# EAGLE design bsides2020 (EAGLE 9.4.2)
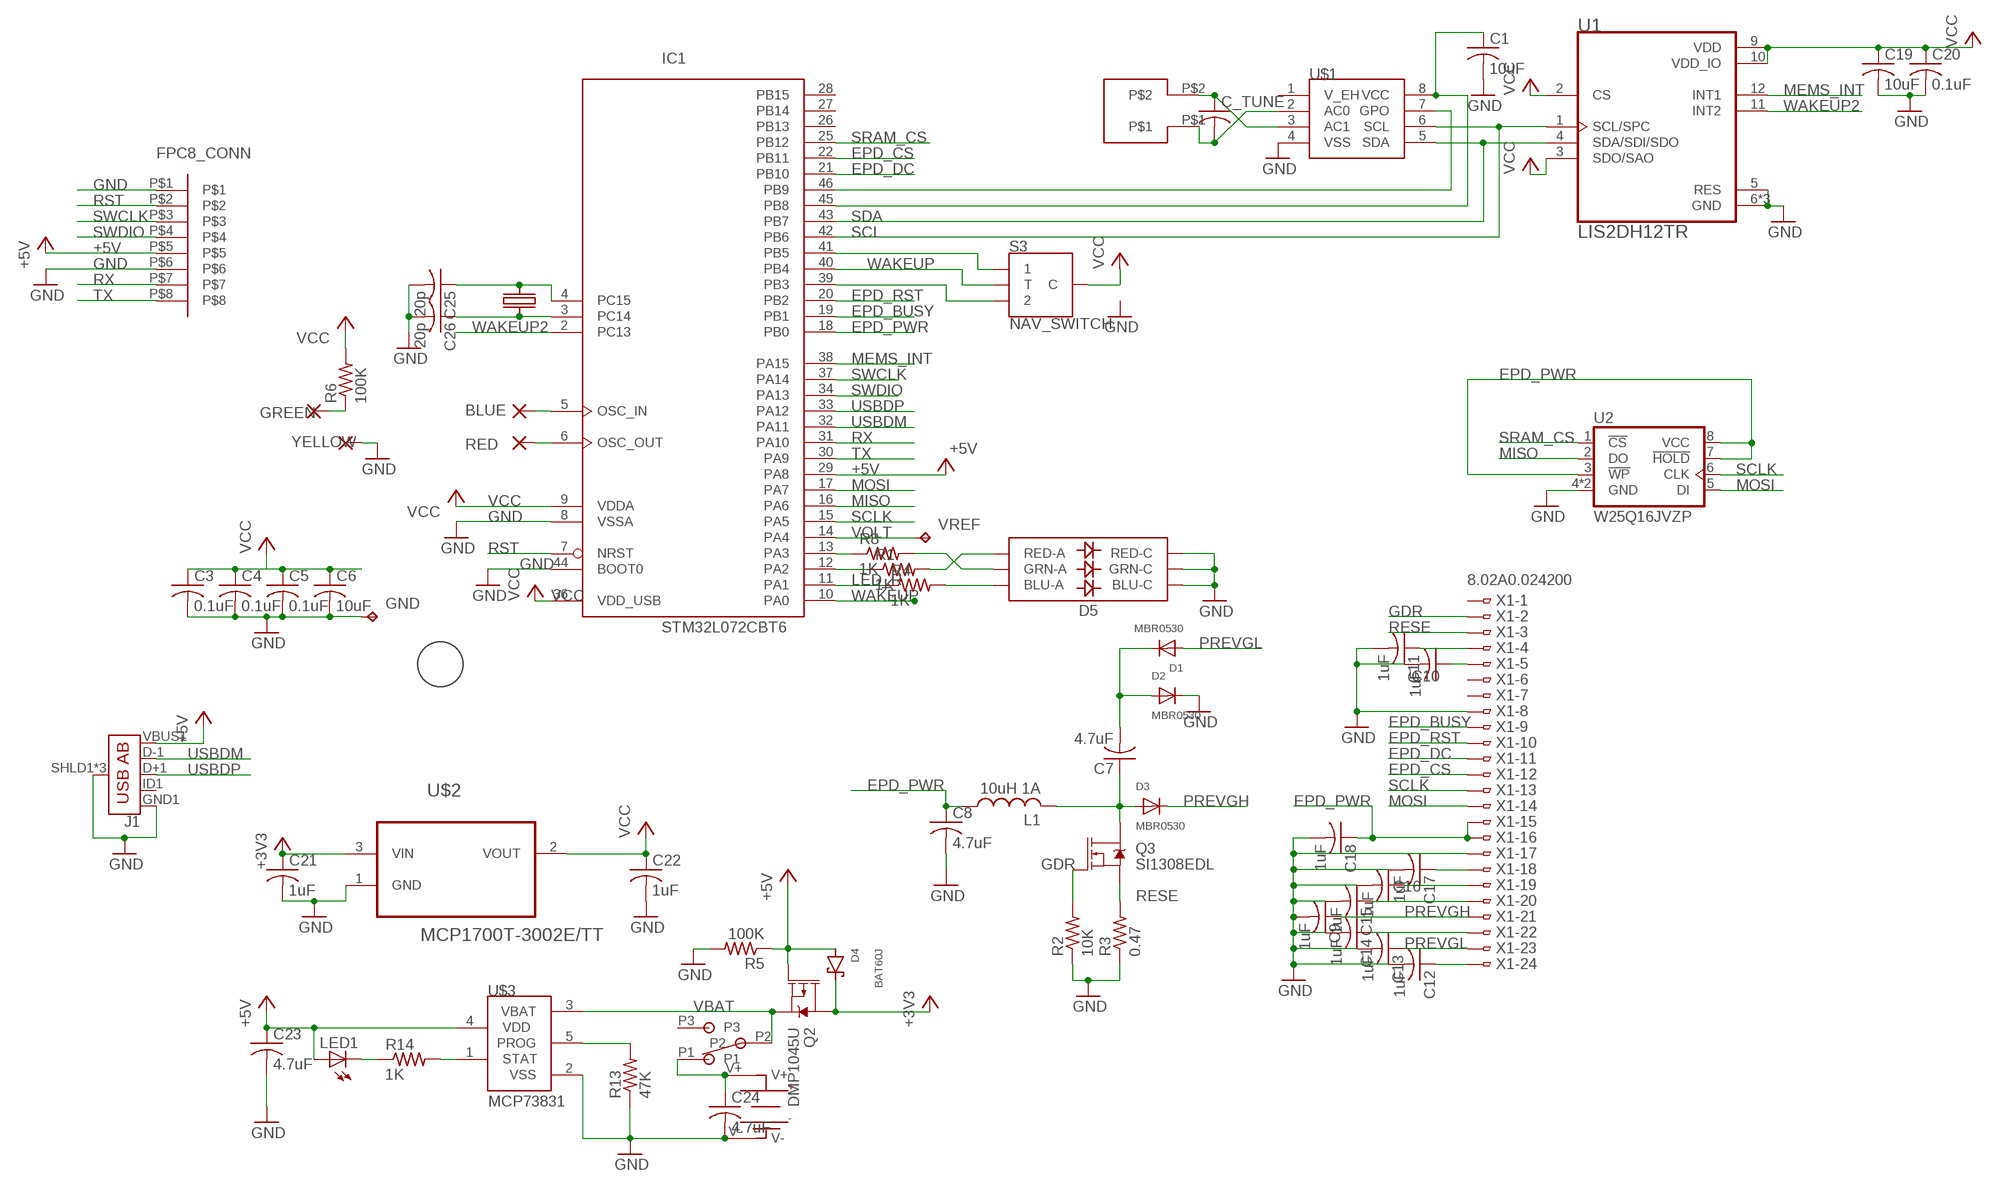
[diagram p0: schematic, sheet 1]

## Parts
BLUE  SMD2  [SMD1,27-2,54]
C1  10uF  C-USC0603  [C0603]
C3  0.1uF  C-USC0603  [C0603]
C4  0.1uF  C-USC0603  [C0603]
C5  0.1uF  C-USC0603  [C0603]
C6  10uF  C-USC0603  [C0603]
C7  4.7uF  C-USC0603  [C0603]
C8  4.7uF  C-USC0603  [C0603]
C9  1uF  C-USC0603  [C0603]
C10  1uF  C-USC0603  [C0603]
C11  1uF  C-USC0603  [C0603]
C12  1uF  C-USC0603  [C0603]
C13  1uF  C-USC0603  [C0603]
C14  1uF  C-USC0603  [C0603]
C15  1uF  C-USC0603  [C0603]
C16  1uF  C-USC0603  [C0603]
C17  1uF  C-USC0603  [C0603]
C18  1uF  C-USC0603  [C0603]
C19  10uF  C-USC0603  [C0603]
C20  0.1uF  C-USC0603  [C0603]
C21  1uF  C-USC0603  [C0603]
C22  1uF  C-USC0603  [C0603]
C23  4.7uF  C-USC0603  [C0603]
C24  4.7uF  C-USC0603  [C0603]
C25  20p  C-USC0603  [C0603]
C26  20p  C-USC0603  [C0603]
C_TUNE  C-USC0603  [C0603]
D1  MBR0530  DIODESOD-123  [SOD-123]
D2  MBR0530  DIODESOD-123  [SOD-123]
D3  MBR0530  DIODESOD-123  [SOD-123]
D4  BAT60J  [SOD323_ST]
D5  RGB  LED-RGBNO_IC  [LED-TRICOLOR-5050]
GND  TPB1,27  [B1,27]
GREEN  SMD2  [SMD1,27-2,54]
IC1  STM32L072CBT6  STM32L052C8T  [LQFP48]
J1  USB_AB_SMT  [USB-AB-MICRO-SMD]
L1  10uH 1A  L-USL2825P  [L2825P]
LED1  LEDCHIPLED_0603  [CHIPLED_0603]
Q2  DMP1045U  MOSFET_PCH-IRLML2244  [SOT23-3]
Q3  SI1308EDL  MOSFET-NCH-AO3404A  [SOT23-3]
R1  1K  R-US_R0603  [R0603]
R2  10K  R-US_R0603  [R0603]
R3  0.47  R-US_R0603  [R0603]
R4  1K  R-US_R0603  [R0603]
R5  100K  R-US_R0603  [R0603]
R6  100K  R-US_R0603  [R0603]
R8  1K  R-US_R0603  [R0603]
R13  47K  R-US_R0603  [R0603]
R14  1K  R-US_R0603  [R0603]
RED  SMD2  [SMD1,27-2,54]
S3  NAV_SWITCH  [NAV_SWITCH]
U1  LIS2DH12TR  LIS2DH12TRLARGE  [LGA-12N]
U2  W25Q16JVZP  W25Q16BVZP  [WSON8]
U$1  ST25DV04K-IER6S3  [SOIC127P600X175-8N]
U$2  MCP1700T-3002E/TT  MCP1700T-3302E/TT  [SOT95P237X112-3N]
U$3  MCP73831  [SOT23-5L]
U$4  ANTANT2  [ANT2]
U$6  20MM_BATTERY180  [20MM_BATTERY_SMD2]
U$7  FPC8_END  [FPC8_END]
U$8  PLUM  [PLUM]
U$9  MSK12C02  [MSK12C02]
U$11  MC-306 32.7680K-A0:ROHS  32KHZCRYSTAL  [32KHZCRYSTAL]
VREF  TPB1,27  [B1,27]
X1  8.02A0.024200  FH12-24S-0.5S  [FPC24]
YELLOW  SMD2  [SMD1,27-2,54]

## Nets
+3V3: C21.1 D4.C Q2.3(D) U$2.3(VIN)
+5V: C23.1 D4.A IC1.29(PA8) J1.VBUS1(VBUS) LED1.A Q2.1(G) R5.1 U$3.4(VDD) U$7.P$5
EPD_BUSY: IC1.19(PB1) X1.P$9
EPD_CS: IC1.22(PB11) X1.P$12
EPD_DC: IC1.21(PB10) X1.P$11
EPD_PWR: C8.1 C18.1 IC1.18(PB0) L1.1 U2.3(!WP!) U2.7(!HOLD!) U2.8(VCC) X1.P$15 X1.P$16
EPD_RST: IC1.20(PB2) X1.P$10
GDR: Q3.1(G) R2.2 X1.P$2
GND: C1.2 C3.2 C4.2 C5.2 C6.2 C8.2 C9.2 C10.2 C11.2 C12.2 C13.2 C14.2 C15.2 C16.2 C17.2 C18.2 C19.2 C20.2 C21.2 C22.2 C23.2 C24.2 C25.2 C26.2 D2.C D5.4(BLU-C) D5.5(RED-C) D5.6(GRN-C) GND.TP IC1.8(VSSA) IC1.44(BOOT0) J1.GND1(GND) J1.SHLD1(SHIELD) J1.SHLD2(SHIELD) J1.SHLD3(SHIELD) R2.1 R3.1 R5.2 R13.1 U1.5(RES) U1.6(GND) U1.7(GND) U1.8(GND) U2.4(GND) U2.9(GND) U$1.4(VSS) U$2.1(GND) U$3.2(VSS) U$6.V- U$7.P$1 U$7.P$6 X1.P$8 X1.P$17 YELLOW.1(P)
LED_R: IC1.11(PA1) R4.1
MEMS_INT: IC1.38(PA15) U1.12(INT1)
MISO: IC1.16(PA6) U2.2(DO)
MOSI: IC1.17(PA7) U2.5(DI) X1.P$14
N$1: R13.2 U$3.5(PROG)
N$2: BLUE.1(P) IC1.5(OSC_IN)
N$3: D5.2(RED-A) R1.2
N$4: D5.1(GRN-A) R8.2
N$5: D5.3(BLU-A) R4.2
N$6: IC1.41(PB5) S3.1
N$7: C24.1 U$6.V+ U$9.P1
N$8: C26.1 IC1.3(PC14) U$11.P$4
N$9: IC1.46(PB9) U$1.7(GPO)
N$10: C_TUNE.2 U$1.2(AC0) U$4.P$1
N$11: C11.1 X1.P$4
N$13: IC1.39(PB3) S3.2
N$14: IC1.12(PA2) R1.1
N$15: IC1.13(PA3) R8.1
N$16: C25.1 IC1.4(PC15) U$11.P$1
N$17: C7.1 D3.A L1.2 Q3.3(D)
N$18: C10.1 X1.P$5
N$19: IC1.6(OSC_OUT) RED.1(P)
N$20: C1.1 IC1.45(PB8) U$1.8(VCC)
N$21: C16.1 X1.P$19
N$22: C15.1 X1.P$20
N$23: C17.1 X1.P$18
N$24: C14.1 X1.P$22
N$25: C12.1 X1.P$24
N$26: GREEN.1(P) R6.1
N$27: C7.2 D1.C D2.A
N$34: C_TUNE.1 U$1.3(AC1) U$4.P$2
N$35: LED1.C R14.1
N$37: R14.2 U$3.1(STAT)
PREVGH: C9.1 D3.C X1.P$21
PREVGL: C13.1 D1.A X1.P$23
RESE: Q3.2(S) R3.2 X1.P$3
RST: IC1.7(NRST) U$7.P$2
RX: IC1.31(PA10) U$7.P$7
SCL: IC1.42(PB6) U1.1(SCL/SPC) U$1.6(SCL)
SCLK: IC1.15(PA5) U2.6(CLK) X1.P$13
SDA: IC1.43(PB7) U1.4(SDA/SDI/SDO) U$1.5(SDA)
SRAM_CS: IC1.25(PB12) U2.1(!CS!)
SWCLK: IC1.37(PA14) U$7.P$3
SWDIO: IC1.34(PA13) U$7.P$4
TX: IC1.30(PA9) U$7.P$8
USBDM: IC1.32(PA11) J1.D-1(D-)
USBDP: IC1.33(PA12) J1.D+1(D+)
VBAT: Q2.2(S) U$3.3(VBAT) U$9.P2
VCC: C3.1 C4.1 C5.1 C6.1 C19.1 C20.1 C22.1 IC1.9(VDDA) IC1.36(VDD_USB) R6.2 S3.C U1.2(CS) U1.3(SDO/SAO) U1.9(VDD) U1.10(VDD_IO) U$2.2(VOUT)
VOLT: IC1.14(PA4) VREF.TP
WAKEUP: IC1.10(PA0) IC1.40(PB4) S3.T
WAKEUP2: IC1.2(PC13) U1.11(INT2)
Unconnected: IC1.26(PB13) IC1.27(PB14) IC1.28(PB15) J1.ID1(USBID) U$1.1(V_EH) U$9.P3 X1.P$1 X1.P$6 X1.P$7

## Power pins joined to a net without a drawn wire
GND: IC1.23(VSS) IC1.35(VSS) IC1.47(VSS)
VCC: IC1.1(VDD) IC1.24(VDD) IC1.48(VDD)

## Library data of the parts
BLUE GREEN RED YELLOW = wirepad:SMD2: SMD PAD
C1 C3-C24 C_TUNE = resistor:C-US: CAPACITOR, American symbol
C25 C26 = adafruit:C-US: CAPACITOR, American symbol; OC_NEWARK: unknown
D1-D3 = adafruit:DIODE: Diode SMADIODE - SMA Surface Mount Package 20V 1A Schottky Diode Digikey: 641-1014-6-ND DO-1N4148 - Through Hole Small Current Diode SOD-123 20V 1 A (.5mV Vf) Schottky Diode - Digikey: MBRX120TPMSCT-ND SOD-323 10V 570mA (.38mV Vf, 3ns) Schottky Diode - Digikey: ZLLS410CT-ND SOD-523 30V 30mA Schottky Diode (RB751S-40TE61) - Digikey: RB751S-40TE61CT-ND SOT23-R/W - SOT23 Package (R = Solder Paste/Reflow Ovens, W = Hand-Soldering) BAT54Film 40V 300mA - Digikey: 497-7162-1-ND
D4 = diode:BAT60J: Schottky barrier diode Source: www.st.com, BAT60J.pdf
D5 = SparkFun-LED:LED-RGB: LED-RGB 6 pin RGB LED (no common connector) Packages: PLCC-6 LED-TRICOLOR-5050 - No built-in IC SparkFun Products: Digital Sandbox <https://www.sparkfun.com/products/12651> LED- SMD RGB <https://www.sparkfun.com/products/10866>; PROD_ID: DIO-10298
GND VREF = testpad:TP: Test pad
IC1 = micro-stm_v2:STM32L052C*T: ARM 32-bit Cortex™-M0+ CPU 32 MHz maximum frequency 32 to 64 Kbytes of Flash memory 2 kbyte of Data EEPROM 8 kbytes of SRAM 37 GPIOs 1.8 to 3.6 V application supply
J1 = SparkFun-Connectors:USB_AB: USB Type AB Micro Connector OTG-compatible. 5 pins, 3 shield pins SparkFun Products: IOIO-OTG <https://www.sparkfun.com/products/13613> SparkFun SAMD21 Mini Breakout <https://www.sparkfun.com/products/13664>; PROD_ID: CONN-11794
L1 = resistor:L-US: INDUCTOR, American symbol
LED1 = led:LED: LED OSRAM: - CHIPLED LG R971, LG N971, LY N971, LG Q971, LY Q971, LO R971, LY R971 LH N974, LH R974 LS Q976, LO Q976, LY Q976 LO Q996 - Hyper CHIPLED LW Q18S LB Q993, LB Q99A, LB R99A - SideLED LS A670, LO A670, LY A670, LG A670, LP A670 LB A673, LV A673, LT A673, LW A673 LH A674 LY A675 LS A676, LA A676, LO A676, LY A676, LW A676 LS A679, LY A679, LG A679 - Hyper Micro SIDELED® LS Y876, LA Y876, LO Y876, LY Y876 LT Y87S - SmartLED LW L88C, LW L88S LB L89C, LB L89S, LG L890 LS L89K, LO L89K, LY L89K LS L896, LA L896, LO L896, LY L896 - TOPLED LS T670, LO T670, LY T670, LG T670, LP T670 LSG T670, LSP T670, LSY T670, LOP T670, LYG T670 LG T671, LOG T671, LSG T671 LB T673, LV T673, LT T673, LW T673 LH T674 LS T676, LA T676, LO T676, LY T676, LB T676, LH T676, LSB T676, LW T676 LB T67C, LV T67C, LT T67C, LS T67K, LO T67K, LY T67K, LW E67C LS E67B, LA E67B, LO E67B, LY E67B, LB E67C, LV E67C, LT E67C LW T67C LS T679, LY T679, LG T679 LS T770, LO T770, LY T770, LG T770, LP T770 LB T773, LV T773, LT T773, LW T773 LH T774 LS E675, LA E675, LY E675, LS T675 LS T776, LA T776, LO T776, LY T776, LB T776 LHGB T686 LT T68C, LB T68C - Hyper Mini TOPLED® LB M676 - Mini TOPLED Santana® LG M470 LS M47K, LO M47K, LY M47K Source: http://www.osram.convergy.de/
Q2 = SparkFun-DiscreteSemi:MOSFET_PCH: P-channel MOSFETs Voltage controlled devices that allow control of high current outputs. SparkFun Products: SparkFun ESP32 Thing <https://www.sparkfun.com/products/13907> SparkFun ESP8266 Thing <https://www.sparkfun.com/products/13231>; PROD_ID: TRANS-11153; VALUE: 4.3A/20V/54mΩ
Q3 = SparkFun-DiscreteSemi:MOSFET-NCH: N-channel MOSFETs Voltage controlled devices that allow control of high current outputs. SparkFun Products: SparkFun OpenScale <https://www.sparkfun.com/products/13261> SparkFun Digital Sandbox <https://www.sparkfun.com/products/12651> SparkFun Monster Moto Shield <https://www.sparkfun.com/products/10182> SparkFun MOSFET Power Controller <https://www.sparkfun.com/products/11214>; PROD_ID: TRANS-12988; VALUE: 5.8A/30V/35mΩ
R1-R6 R8 R13 R14 = resistor:R-US_: RESISTOR, American symbol
S3 = SparkFun-Switches:NAV_SWITCH: Navigation Switch Three way navigation switch. Commonly used as up/down/select on MP3 players. Schematic element and footprint production proven. SparkFun Products Surface Mount Navigation Switch <https://www.sparkfun.com/products/8184> (COM-08184) Used on SparkFun MP3 Trigger <https://www.sparkfun.com/products/13720>; PROD_ID: SWCH-08301; SF_SKU: COM-08184
U1 = grange:LIS2DH12TR: MEMS digital output motion sensor: ultra low-power high performance 3-axes femto accelerometer
U2 = memory-winbond:W25Q16BV: EEPROM 4 Mbit SPI Serial Flash7
U$1 = grange:ST25DV04K-IER6S3
U$2 = Ava:MCP1700T-3302E/TT: Low Quiescent Current LDO; MPN: MCP1700T-3302E/TT; OC_FARNELL: 1296592; OC_NEWARK: 88H9817; PACKAGE: SOT23-3; SUPPLIER: Microchip
U$3 = mcp73831:MCP73831: Miniature Single-Cell, Fully Integrated Li-Ion, Li-Polymer Charge Management Controllers
U$4 = grange:ANT
U$6 = grange:20MM_BATTERY
U$7 = grange:FPC8_END
U$8 = grange:PLUM
U$9 = grange:MSK12C02
U$11 = grange:32KHZCRYSTAL
X1 = grange:FH12-24S-0.5S: 0.5mm Pitch Connectors For FPC/FFC Source: Data sheet <http://www.hirose.co.jp/cataloge_hp/e58605370.pdf>

## Board
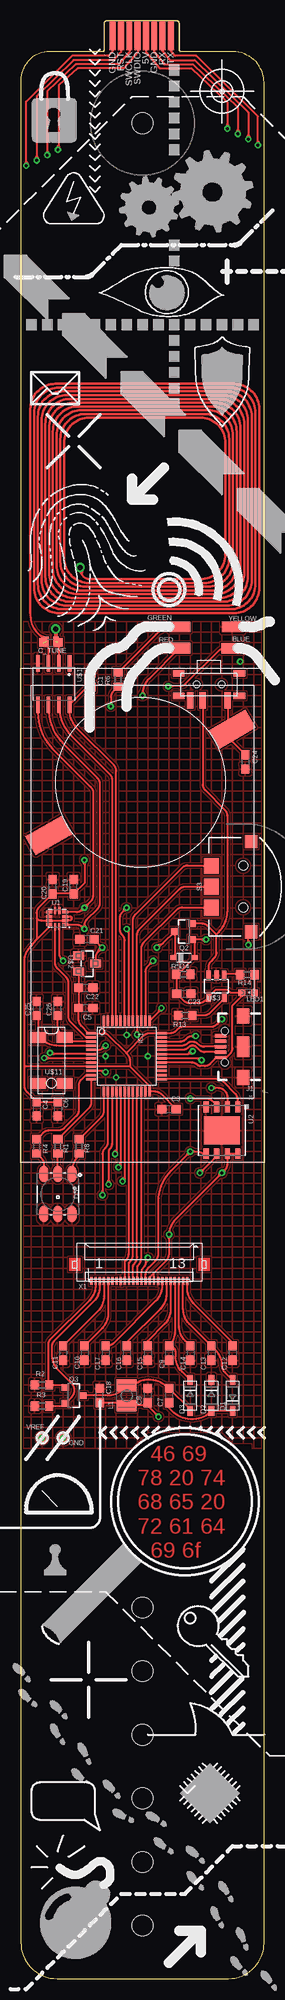
[diagram p1: board, top side]
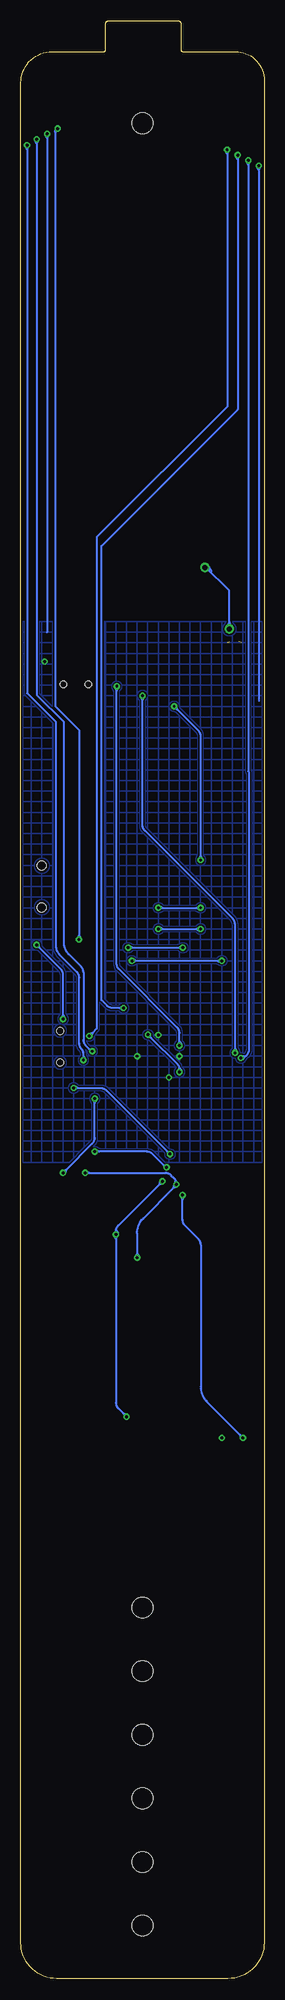
[diagram p2: board, bottom side, seen from below]

Size 29.19 x 234.51 mm. Coordinates in mm from the lower left corner, seen from the top.
Outline: 25.47,230.81 19.3,230.81 arc-90 19,231.11 19,234.21 arc90 18.7,234.51 10.3,234.51 arc90 10,234.21 10,231.11 arc-90 9.7,230.81 3.75,230.81 arc90 0,227.69 0,4.34 arc90 4.34,0 24.89,0 arc90 29.19,4.3 29.19,227.09 arc90 25.47,230.81
Copper layers (1*16): Top 0.035mm / dielectric 1.5mm / Bottom 0.035mm
Design rules "default *": minimum track width 6mil, minimum drill 0.35mm, track to track 6mil, track to pad 6mil, pad to pad 6mil, via to via 6mil, smd to smd 6mil, copper to edge 10mil, drill to drill 6mil, minimum pad ring 10mil, minimum via ring 8mil, stop-mask expansion 4mil, vias tented up to drill 0mil, thermal gap 10mil
Holes 2.5 mm at 14.6,222.25 14.6,6.35 14.6,13.97 14.6,21.59 14.6,29.21 14.6,36.83 14.6,44.45

### Footprints (pad centres in the part's own frame; a part is rotated, then mirrored left to right if it is on the bottom)
SMD1,27-2,54 = smd 1.27 x 2.54: 1 0,0
C0603 = smd 1.1 x 1: 1 -0.85,0; 2 0.85,0
SOD-123 = smd 1.2 x 0.7: A 1.85,0; C -1.85,0
SOD323_ST = smd 0.8 x 0.6: A 1.25,0; C -1.25,0
LED-TRICOLOR-5050 = smd 2 x 1.1: 1 -2.4,1.7; 2 -2.4,0; 3 -2.4,-1.7; 4 2.4,-1.7; 5 2.4,0; 6 2.4,1.7
B1,27 = smd 1.27 x 1.27: TP 0,0
LQFP48 = smd 0.3 x 1.2: 1 -2.75,-4.25; 2 -2.25,-4.25; 3 -1.75,-4.25; 4 -1.25,-4.25; 5 -0.75,-4.25; 6 -0.25,-4.25; 7 0.25,-4.25; 8 0.75,-4.25; 9 1.25,-4.25; 10 1.75,-4.25; 11 2.25,-4.25; 12 2.75,-4.25; 25 2.75,4.25; 26 2.25,4.25; 27 1.75,4.25; 28 1.25,4.25; 29 0.75,4.25; 30 0.25,4.25; 31 -0.25,4.25; 32 -0.75,4.25; 33 -1.25,4.25; 34 -1.75,4.25; 35 -2.25,4.25; 36 -2.75,4.25 | smd 1.2 x 0.3: 13 4.25,-2.75; 14 4.25,-2.25; 15 4.25,-1.75; 16 4.25,-1.25; 17 4.25,-0.75; 18 4.25,-0.25; 19 4.25,0.25; 20 4.25,0.75; 21 4.25,1.25; 22 4.25,1.75; 23 4.25,2.25; 24 4.25,2.75; 37 -4.25,2.75; 38 -4.25,2.25; 39 -4.25,1.75; 40 -4.25,1.25; 41 -4.25,0.75; 42 -4.25,0.25; 43 -4.25,-0.25; 44 -4.25,-0.75; 45 -4.25,-1.25; 46 -4.25,-1.75; 47 -4.25,-2.25; 48 -4.25,-2.75
USB-AB-MICRO-SMD = smd 1.4 x 0.4: D+1 2.7,0; D-1 2.7,0.65; GND1 2.7,-1.3; ID1 2.7,-0.65; VBUS1 2.7,1.3 | smd 1.5 x 1.8: SHLD1 0,-3.68; SHLD2 0,3.68 | smd 1.5 x 2.5: SHLD3 0,0 | hole 0.85: 2.2,1.9; 2.2,-1.9
L2825P = smd 1.4 x 2.4: 1 -1.2,0; 2 1.2,0
CHIPLED_0603 = smd 0.8 x 0.8: A 0,-0.75; C 0,0.75
SOT23-3 = smd 0.8 x 0.9: 1 -0.95,-1; 2 0.95,-1; 3 0,1.1
R0603 = smd 1 x 1.1: 1 -0.85,0; 2 0.85,0
NAV_SWITCH = smd 1.9 x 1.8: 1 -2.5,-3.8; 2 2.5,-3.8; T 0,-3.8 | smd 1.6 x 1.5: C 5.4,0.95; NC -5.4,0.95 | hole 1.1: -2.5,0; 2.5,0
LGA-12N = smd 0.831 x 0.35: 1 -0.956,0.75; 2 -0.956,0.25; 3 -0.956,-0.25; 4 -0.956,-0.75; 7 0.956,-0.75; 8 0.956,-0.25; 9 0.956,0.25; 10 0.956,0.75 | smd 0.35 x 0.831: 5 -0.265,-0.956; 6 0.25,-0.956; 11 0.25,0.956; 12 -0.25,0.956
WSON8 = smd 0.635 x 1.27: 1 -1.905,-2.81; 2 -0.635,-2.81; 3 0.635,-2.81; 4 1.905,-2.81; 5 1.905,2.81; 6 0.635,2.81; 7 -0.635,2.81; 8 -1.905,2.81 | smd 4.3 x 3.4: 9 0,0
SOIC127P600X175-8N = smd 1.97 x 0.57: 1 -2.475,1.905; 2 -2.475,0.635; 3 -2.475,-0.635; 4 -2.475,-1.905; 5 2.475,-1.905; 6 2.475,-0.635; 7 2.475,0.635; 8 2.475,1.905
SOT95P237X112-3N = smd 0.991 x 1.321: 1 -0.94,-1.016; 2 0.94,-1.016; 3 0,1.016
SOT23-5L = smd 0.533 x 1.2: 1 -0.95,-1.3; 2 0,-1.3; 3 0.95,-1.3 | smd 0.55 x 1.2: 4 0.95,1.3; 5 -0.95,1.3
ANT2 = smd 0.635 x 1.27: P$1 3.048,-3.429; P$2 1.905,-3.429 | drill 0.6: P$3 5.969,5.461; P$4 3.048,-1.905
20MM_BATTERY_SMD2 = smd 5.08 x 2.54: V+ 12.7,0; V- -12.7,0
FPC8_END = smd 0.7 x 3.5: P$1 1,2; P$2 2,2; P$3 3,2; P$4 4,2; P$5 5,2; P$6 6,2; P$7 7,2; P$8 8,2
MSK12C02 = smd 1.4 x 0.8: NC1 -3.65,1.35; NC2 -3.65,-1.35; NC3 3.65,1.35; NC4 3.65,-1.35 | smd 0.8 x 2: P1 -2.25,1.9; P2 0.75,1.9; P3 2.25,1.9 | hole 0.8: -1.5,0; 1.5,0
32KHZCRYSTAL = smd 1.3 x 1.9: P$1 -6.2,1; P$2 -0.7,1; P$3 -0.7,4.2; P$4 -6.2,4.2
FPC24 = smd 0.28 x 0.9: P$1 5.75,0.5; P$2 5.25,0.5; P$3 4.75,0.5; P$4 4.25,0.5; P$5 3.75,0.5; P$6 3.25,0.5; P$7 2.75,0.5; P$8 2.25,0.5; P$9 1.75,0.5; P$10 1.25,0.5; P$11 0.75,0.5; P$12 0.25,0.5; P$13 -0.25,0.5; P$14 -0.75,0.5; P$15 -1.25,0.5; P$16 -1.75,0.5; P$17 -2.25,0.5; P$18 -2.75,0.5; P$19 -3.25,0.5; P$20 -3.75,0.5; P$21 -4.25,0.5; P$22 -4.75,0.5; P$23 -5.25,0.5; P$24 -5.75,0.5

### Placement (x,y rotation side)
BLUE  25.35,159.36 90 top
C1  8.48,155.56 90 top
C3  17.78,104.14 180 top
C4  1.91,104.17 270 top
C5  7.78,116.27 0 top
C6  4.45,104.17 270 top
C7  17.78,69.85 270 top
C8  15.24,69.85 90 top
C9  17.78,74.93 270 top
C10  7.62,74.93 270 top
C11  5.08,74.93 270 top
C12  25.4,74.93 270 top
C13  22.86,74.93 270 top
C14  20.32,74.93 270 top
C15  15.24,74.93 270 top
C16  12.7,74.93 270 top
C17  10.16,74.93 270 top
C18  9.46,69.85 90 top
C19  6.35,130.81 90 top
C20  3.81,130.81 90 top
C21  7.94,124.48 180 top
C22  7.78,118.69 0 top
C23  19.55,117.98 0 top
C24  26.93,145.75 270 top
C25  1.91,116.2 90 top
C26  4.45,116.2 90 top
C_TUNE  3.59,160.05 0 top
D1  25.4,69.85 90 top
D2  22.86,69.85 270 top
D3  20.32,69.85 270 top
D4  19.58,122.29 0 top
D5  4.45,93.98 270 top
GND  5.08,64.77 0 top
GREEN  19.05,161.93 90 top
IC1  12.7,110.49 270 top
J1  26.67,111.63 180 top
L1  12.7,69.85 90 top
LED1  27.27,118.11 270 top
Q2  19.58,125.43 90 top
Q3  6.35,69.85 270 top
R1  4.45,99.7 270 top
R2  2.54,71.12 0 top
R3  2.54,68.58 0 top
R4  1.91,99.7 270 top
R5  19.5,120.31 0 top
R6  11.66,155.62 270 top
R8  6.99,99.7 270 top
R13  19.72,115.37 0 top
R14  27.17,120.25 180 top
RED  19.05,159.38 90 top
S3  26.67,130.81 270 top
U1  4.36,127 180 top
U2  24.13,101.6 180 top
U$1  3.95,155.07 270 top
U$2  7.94,121.59 270 top
U$3  23.46,118.88 180 top
U$4  1.14,163.58 0 top
U$5  EPD_2.13  [EPD_2.13]  0,97.79 0 top
U$6  14.36,143.31 30 top
U$7  10,230.76 0 top
U$8  4.11,48.33 0 top
U$9  22.57,155.01 180 top
U$11  1.07,106.55 270 top
VREF  2.54,64.77 0 top
X1  14.22,84.07 180 top
YELLOW  25.4,161.93 90 top

### Tracks (layer width: path | path; a pad name or v marks a point on that pad's centre or on a via)
+3V3  (via drill 0.35)
  Top 0.254: 9.35,123.16 9.69,123.49 v9.76,123.49 | v16.31,123.49 16.68,123.86 | 16.68,123.86 arc45 17.07,124.02 Q2.3 18.48,122.44 D4.C | C21.1 9.4,123.87 | 9.4,123.87 9.76,123.51 v9.76,123.49 | v9.76,123.49 9.39,123.12 | 9.39,123.12 9.25,122.98 arc45 8.96,122.27 U$2.3 | 9.35,123.16 9.81,123.24 v9.76,123.49 | 9.35,123.16 9.53,123.59 v9.76,123.49 | 9.4,123.87 9.52,123.43 v9.76,123.49 | 9.4,123.87 9.84,123.73 v9.76,123.49 | 9.39,123.12 9.83,123.25 v9.76,123.49 | 9.39,123.12 9.52,123.56 v9.76,123.49 | 16.68,123.86 16.24,123.73 v16.31,123.49 | 16.68,123.86 16.55,123.42 v16.31,123.49
  Bottom 0.254: v16.31,123.49 15.79,123.49 | 15.79,123.49 10.29,123.49 | 10.29,123.49 v9.76,123.49 | 10.29,123.49 | 10.29,123.49 | 10.29,123.49 9.88,123.27 | 10.29,123.49 9.88,123.71 | 9.88,123.71 | v9.76,123.49 9.88,123.71 | 10.29,123.49 9.88,123.27 | v9.76,123.49 9.88,123.27 | 10.29,123.49 9.88,123.71 | v9.76,123.49 9.88,123.71 | 10.29,123.49 9.88,123.27 | v9.76,123.49 9.88,123.27 | 15.79,123.49 16.19,123.27 v16.31,123.49 | 15.79,123.49 16.19,123.71 v16.31,123.49
+5V  (via drill 0.35)
  Top 0.254: IC1.29 20.5,109.74 arc-45 21.2,109.45 arc45 21.53,109.31 22.04,109.31 arc45 22.75,109.61 23.47,110.33 J1.VBUS1 24.64,110.33 25.11,110.79 arc45 25.4,111.5 25.4,116.58 26.52,117.7 LED1.A 25.15,118.11 24.8,118.46 23.39,118.46 U$3.4 22.06,117.13 arc-45 21.36,116.84 20.25,116.84 arc-45 19.55,117.13 C23.1 18.65,118.03 18.65,120.11 | R5.1 18.65,120.11 | 18.65,120.11 D4.A 20.83,124.23 Q2.1 20.6,124.46 21.7,124.46 | U$7.P$5 15,230.75 16.64,228.81 20.45,228.81 24.77,224.79 24.77,222.14 | 24.77,222.14 v24.77,221.62 | v22.23,124.46 21.7,124.46 | 24.77,222.14 24.54,221.74 v24.77,221.62 | 24.77,222.14 24.99,221.74 v24.77,221.62 | 21.7,124.46 22.11,124.24 v22.23,124.46 | 21.7,124.46 22.11,124.68 v22.23,124.46
  Bottom 0.254: 22.22,124.98 22.22,149.56 25.07,152.41 25.07,221.18 | 22.22,124.98 v22.22,124.47 v22.23,124.46 | v24.77,221.62 25.07,221.31 25.07,221.18 | 25.07,221.18 25.02,221.64 v24.77,221.62 | 25.07,221.18 24.65,221.39 v24.77,221.62 | 22.22,124.98 22,124.58 v22.23,124.46 | 22.22,124.98 22.44,124.58 v22.23,124.46
EPD_BUSY
  Top 0.254: X1.P$9 12.47,85.76 arc-45 12.58,86.01 arc45 12.95,86.91 IC1.19
EPD_CS
  Top 0.254: X1.P$12 13.97,85.21 arc-45 14.08,85.46 arc45 14.45,86.36 IC1.22
EPD_DC
  Top 0.254: X1.P$11 13.47,85.34 arc-45 13.58,85.59 arc45 13.95,86.49 IC1.21
EPD_PWR  (via drill 0.35)
  Top 0.254: C18.1 12.35,69 L1.1 14.89,68.65 C8.1 15.24,68.58 16.14,67.68 | U2.8 U2.7 24.77,97.57 arc-45 24.47,96.86 v24.13,96.52 | v20.32,105.41 20.84,105.41 | 20.84,105.41 22.33,105.41 arc-45 22.92,105.17 23.5,104.59 U2.3 | 17.83,89.64 arc-33 18.52,90.91 23.76,96.15 | 17.83,89.64 arc12 v17.78,89.12 | 23.76,96.15 v24.13,96.52 | X1.P$16 15.97,84.55 | 15.97,84.55 17.41,85.99 arc45 17.78,86.89 17.78,88.59 | X1.P$15 15.47,84.05 15.97,84.55 | v17.78,89.12 17.78,88.59 | v12.2,95.51 12.45,95.76 12.45,95.97 | IC1.18 12.45,95.97 | v16.51,67.31 16.14,67.68 | 12.45,95.97 12.06,95.72 v12.2,95.51 | 12.45,95.97 12.45,95.51 v12.2,95.51 | v24.13,96.52 24.06,96.76 24.5,96.89 24.37,96.45 v24.13,96.52 | 23.76,96.15 24.2,96.28 v24.13,96.52 | 23.76,96.15 23.89,96.59 v24.13,96.52 | 20.84,105.41 20.44,105.63 v20.32,105.41 | 20.84,105.41 20.44,105.19 v20.32,105.41 | 17.83,89.64 17.57,89.26 v17.78,89.12 | 17.83,89.64 18.01,89.22 v17.78,89.12 | 17.78,88.59 18,89 v17.78,89.12 | 17.78,88.59 17.56,89 v17.78,89.12 | 16.14,67.68 16.27,67.24 v16.51,67.31 | 16.14,67.68 16.58,67.55 v16.51,67.31
  Bottom 0.254: v17.78,89.12 17.78,89.52 arc45 17.49,90.23 12.57,95.14 | v24.13,96.52 23.76,96.89 | 23.76,96.89 20.61,100.04 arc-45 20.32,100.74 20.32,104.89 | 20.32,104.89 v20.32,105.41 | v17.78,89.12 17.78,88.59 | 17.78,88.59 17.78,68.99 arc-45 17.49,68.29 16.88,67.68 | 12.57,95.14 v12.2,95.51 | 16.88,67.68 v16.51,67.31 | 12.57,95.14 12.44,95.58 v12.2,95.51 | 12.57,95.14 12.13,95.27 v12.2,95.51 | 23.76,96.89 23.89,96.45 v24.13,96.52 | 23.76,96.89 24.2,96.76 v24.13,96.52 | 20.32,104.89 20.54,105.29 v20.32,105.41 | 20.32,104.89 20.1,105.29 v20.32,105.41 | v17.78,89.12 17.56,89.23 17.77,89.64 18,89.24 v17.78,89.12 | 17.78,88.59 18,89 v17.78,89.12 | 17.78,88.59 17.56,89 v17.78,89.12 | 16.88,67.68 16.44,67.55 v16.51,67.31 | 16.88,67.68 16.75,67.24 v16.51,67.31
EPD_RST
  Top 0.254: X1.P$10 12.97,85.63 arc-45 13.08,85.88 arc45 13.45,86.78 IC1.20
GDR
  Top 0.254: X1.P$2 8.97,83.05 arc-45 8.23,81.25 3.48,76.5 arc45 3.29,76.04 3.29,71.22 R2.2 5.03,71.12 Q3.1
GND  (via drill 0.35)
  Top 0.254: 3.61,127.77 U1.7 U1.8 | U$7.P$6 15.97,232.73 15.97,230.79 17.23,229.31 20.66,229.31 26.04,224.16 26.04,221.5 | 26.04,221.5 v26.04,220.98 | U$7.P$1 11,230.86 10.5,230.31 6.15,230.31 0.64,224.84 0.64,217.69 | v0.64,217.17 0.64,217.69 | 26.04,221.5 25.81,221.1 v26.04,220.98 | 26.04,221.5 26.26,221.1 v26.04,220.98 | 0.64,217.69 0.41,217.29 v0.64,217.17 | 0.64,217.69 0.86,217.29 v0.64,217.17
  Bottom 0.254: v26.04,220.98 26.04,220.45 | 26.04,220.45 26.04,161.29 | v0.64,217.17 0.64,216.64 | 0.64,216.64 0.64,153.03 | 26.04,220.45 26.26,220.86 v26.04,220.98 | 26.04,220.45 25.81,220.86 v26.04,220.98 | 0.64,216.64 0.86,217.05 v0.64,217.17 | 0.64,216.64 0.41,217.05 v0.64,217.17
  other vias: 5.08,64.77 10.16,110.49 12.7,113.03 15.24,110.49 11.43,107.95 26.32,157.76
  pour Top (rank 2, hatched): -16.51,63.5 -16.51,154.94 -8.89,162.56 35.56,162.56 35.56,63.5 26.04,63.5 24.13,65.41 15.24,65.41 13.34,63.5
  pour Bottom (hatched): -5.08,162.56 40.01,162.56 56.52,146.05 56.52,97.79 -3.81,97.79 -5.08,99.06
LED_R
  Top 0.254: IC1.11 8.42,108.27 8.05,108.27 arc45 7.68,108.12 7.23,107.66 arc45 6.94,106.96 6.94,104.03 arc-45 6.64,103.32 5.22,101.89 arc-45 4.51,101.6 3.37,101.6 arc45 2.67,101.31 R4.1
MEMS_INT  (via drill 0.35)
  Top 0.254: U1.12 4.61,122.8 arc45 4.9,122.1 v5.08,121.92 | v15.88,121.92 15.5,121.55 | 15.5,121.55 15.24,121.29 arc45 14.95,120.58 IC1.38 | v5.08,121.92 4.83,121.87 4.74,122.32 5.17,122.16 v5.08,121.92 | 15.5,121.55 15.95,121.68 v15.88,121.92 | 15.5,121.55 15.63,121.99 v15.88,121.92
  Bottom 0.254: v5.08,121.92 5.61,121.92 | 5.61,121.92 15.35,121.92 | 15.35,121.92 v15.88,121.92 | 5.61,121.92 5.2,122.14 v5.08,121.92 | 5.61,121.92 5.2,121.7 v5.08,121.92 | 15.35,121.92 15.76,121.7 v15.88,121.92 | 15.35,121.92 15.76,122.14 v15.88,121.92
MISO  (via drill 0.35)
  Top 0.254: IC1.16 11.5,106.19 11.5,99.24 | 11.5,99.24 11.5,98.97 v11.29,98.76 | 23.39,106.68 23.72,106.68 arc-45 24.42,106.39 24.47,106.34 arc-45 24.77,105.63 U2.2 | 23.39,106.68 v22.86,106.68 | 11.5,99.24 11.14,98.96 v11.29,98.76 | 11.5,99.24 11.54,98.78 v11.29,98.76 | 23.39,106.68 22.98,106.9 v22.86,106.68 | 23.39,106.68 22.98,106.46 v22.86,106.68
  Bottom 0.254: v22.86,106.68 22.34,106.68 | 22.34,106.68 19.63,106.68 arc45 18.92,106.39 11.66,99.13 | 11.66,99.13 v11.29,98.76 | 11.66,99.13 11.22,99 v11.29,98.76 | 11.66,99.13 11.53,98.69 v11.29,98.76 | 22.34,106.68 22.74,106.46 v22.86,106.68 | 22.34,106.68 22.74,106.9 v22.86,106.68
MOSI  (via drill 0.35)
  Top 0.254: v11.7,97.19 11.95,97.44 11.95,97.65 | IC1.17 11.95,97.65 | v20.32,99.06 20.84,99.06 | 20.84,99.06 21.21,99.06 arc-45 21.86,98.79 U2.5 | 19.95,98.69 18.07,96.81 arc45 16.51,93.04 16.51,86.89 arc-45 16.14,85.99 15.35,85.2 arc45 14.97,84.3 X1.P$14 | 19.95,98.69 v20.32,99.06 | 11.95,97.65 11.56,97.4 v11.7,97.19 | 11.95,97.65 11.95,97.19 v11.7,97.19 | 20.84,99.06 20.44,99.28 v20.32,99.06 | 20.84,99.06 20.44,98.84 v20.32,99.06 | 19.95,98.69 20.39,98.82 v20.32,99.06 | 19.95,98.69 20.08,99.13 v20.32,99.06
  Bottom 0.254: 12.12,97.51 11.8,97.19 v11.7,97.19 | 12.12,97.51 13.38,98.77 arc-45 14.08,99.06 19.8,99.06 | 19.8,99.06 v20.32,99.06 | 12.12,97.51 11.66,97.44 v11.7,97.19 | 12.12,97.51 11.93,97.09 v11.7,97.19 | 19.8,99.06 20.2,98.84 v20.32,99.06 | 19.8,99.06 20.2,99.28 v20.32,99.06
N$1
  Top 0.254: R13.2 21.96,115.37 arc45 22.66,115.66 24.41,117.41 U$3.5
N$2  (via drill 0.35)
  Top 0.254: IC1.5 9.23,111.24 arc33 9.77,111.4 | 9.77,111.4 arc12 9.93,111.53 v10.16,111.76 | BLUE.1 24.44,159.36 arc45 23.74,159.06 19.77,155.1 arc-45 19.07,154.81 18.2,154.81 | 18.2,154.81 v17.68,154.81 | 9.77,111.4 10.22,111.52 v10.16,111.76 | 9.77,111.4 9.92,111.84 v10.16,111.76 | 18.2,154.81 17.8,155.03 v17.68,154.81 | 18.2,154.81 17.8,154.58 v17.68,154.81
  Bottom 0.254: v10.16,111.76 10.16,112.28 | 10.16,112.28 10.16,113.25 arc-45 10.45,113.96 17.49,120.99 arc45 17.68,121.46 17.68,154.28 | 17.68,154.28 v17.68,154.81 | 10.16,112.28 9.94,111.88 v10.16,111.76 | 10.16,112.28 10.38,111.88 v10.16,111.76 | 17.68,154.28 17.9,154.69 v17.68,154.81 | 17.68,154.28 17.46,154.69 v17.68,154.81
N$3
  Top 0.254: D5.2 R1.2
N$4
  Top 0.254: D5.1 6.14,96.58 arc-45 6.99,98.61 R8.2
N$5
  Top 0.254: R4.2 2.45,98.3 arc-45 2.75,97.59 D5.3
N$6
  Top 0.254: IC1.41 13.45,126.77 arc-45 13.74,127.47 19.33,133.06 arc-45 20.03,133.35 22.83,133.35 S3.1
N$7
  Top 0.254: U$9.P1 24.82,150.2 U$6.V+ 25.36,148.18 C24.1
N$8
  Top 0.254: C26.1 4.45,113.98 arc45 4.74,113.28 U$11.P$4 5.78,112.24 IC1.3
N$9
  Top 0.254: IC1.46 10.95,143.58 arc45 10.66,144.28 6.04,148.9 arc-45 4.59,152.39 4.58,152.4 U$1.7
N$10  (1 unrouted)
  Top 0.254: U$1.2 4.58,159.9 C_TUNE.2
N$11
  Top 0.254: X1.P$4 9.97,81.73 arc-45 9.23,79.93 C11.1
N$13
  Top 0.254: IC1.39 14.45,123.39 arc-45 14.74,124.09 18.67,128.02 arc-45 19.37,128.31 S3.2
N$14
  Top 0.254: IC1.12 8.45,104.96 arc-45 8.16,104.26 R1.1
N$15
  Top 0.254: IC1.13 9.95,103.92 arc-45 9.66,103.22 R8.1 | R8.1
N$16
  Top 0.254: C25.1 2.07,115.19 U$11.P$1 2.16,112.75 arc45 4.59,111.74 IC1.4
N$17
  Top 0.254: Q3.3 10.45,69.85 arc45 12.24,70.59 L1.2 13.51,71.05 arc-45 15.28,71.78 arc-45 17.7,70.78 C7.1 20.32,68.16 D3.A
N$18
  Top 0.254: X1.P$5 10.47,79.69 arc-45 9.73,77.89 C10.1
N$19  (via drill 0.35)
  Top 0.254: IC1.6 3.99,110.74 | 3.99,110.74 3.87,110.74 arc-45 v3.49,110.9 | RED.1 15.35,155.68 arc45 14.61,153.89 v14.61,153.67 | 3.99,110.74 3.67,111.07 v3.49,110.9 | 3.99,110.74 3.54,110.65 v3.49,110.9 | v14.61,153.67 14.39,153.8 14.62,154.19 14.83,153.78 v14.61,153.67
  Bottom 0.254: v3.49,110.9 3.49,111.42 | 3.49,111.42 3.49,126.26 arc-45 3.78,126.97 14.31,137.5 arc45 14.61,138.21 14.61,153.15 | 14.61,153.15 v14.61,153.67 | 3.49,111.42 3.27,111.02 v3.49,110.9 | 3.49,111.42 3.71,111.02 v3.49,110.9 | 14.61,153.15 14.83,153.55 v14.61,153.67 | 14.61,153.15 14.38,153.55 v14.61,153.67
N$20
  Top 0.254: C1.1 7.97,154.71 U$1.8 5.86,152.35 5.78,152.27 arc45 6.87,149.65 11.16,145.35 arc-45 11.45,144.65 IC1.45
N$21
  Top 0.254: C16.1 12.7,76.2 16.73,80.23 arc45 17.47,82.03 X1.P$19
N$22
  Top 0.254: X1.P$20 17.97,80.2 arc-45 17.23,78.41 15.24,76.41 C15.1
N$23
  Top 0.254: C17.1 arc45 11.24,76.23 16.23,81.22 arc45 16.97,83.01 X1.P$18
N$24
  Top 0.254: C14.1 19.72,76.38 arc-45 18.97,78.18 X1.P$22
N$25
  Top 0.254: X1.P$24 19.97,82.68 arc45 20.72,80.88 25.4,76.2 C12.1
N$26
  Top 0.254: GREEN.1 18.43,161.93 arc45 16.19,161 R6.1
N$27
  Top 0.254: D1.C D2.A 22.93,68 arc-90 18.14,68 17.78,68.37 C7.2
N$34  (1 unrouted)
  Top 0.254: 3.05,159.87 U$4.P$2 | U$1.3 3.31,159.47 C_TUNE.1
N$35
  Top 0.254: R14.1 LED1.C
N$37
  Top 0.254: R14.2 26.22,120.35 24.58,120.35 U$3.1
PREVGH
  Top 0.254: X1.P$21 18.47,77.46 arc-45 C9.1 arc-90 18.56,75 18.56,74.51 arc45 19.3,72.72 D3.C
PREVGL
  Top 0.254: X1.P$23 19.47,80.22 arc45 20.22,78.42 C13.1 23.39,75.25 arc-45 24.13,73.46 arc45 24.48,72.62 D1.A
RESE
  Top 0.254: X1.P$3 9.47,82.92 arc-45 8.73,81.12 4.03,76.42 arc45 3.71,75.65 3.71,74.74 arc45 4.45,72.94 6.07,71.33 arc-90 6.07,69.64 5.35,68.92 Q3.2 5.03,68.58 R3.2
RST  (via drill 0.35)
  Top 0.254: U$7.P$2 12.03,232.73 12.03,230.79 11.14,229.81 6.32,229.81 1.91,225.49 1.91,218.33 | 1.91,218.33 v1.91,217.81 | v2.81,110.29 2.86,110.24 3.33,110.24 | IC1.7 3.33,110.24 | 1.91,218.33 1.68,217.93 v1.91,217.81 | 1.91,218.33 2.13,217.93 v1.91,217.81 | 3.33,110.24 2.95,110.5 v2.81,110.29 | 3.33,110.24 2.91,110.06 v2.81,110.29
  Bottom 0.254: v1.91,217.81 1.91,217.28 | 1.91,217.28 1.91,144.59 1.78,144.47 1.78,111.36 arc45 2.08,110.66 2.3,110.43 | 2.3,110.43 2.44,110.29 v2.81,110.29 | 1.91,217.28 2.13,217.69 v1.91,217.81 | 1.91,217.28 1.68,217.69 v1.91,217.81 | 2.3,110.43 2.64,110.11 v2.81,110.29 | 2.3,110.43 2.75,110.53 v2.81,110.29
RX  (via drill 0.35)
  Top 0.254: IC1.31 19.86,110.74 arc45 20.56,111.03 v20.62,111.09 | U$7.P$7 16.97,232.73 16.97,230.89 17.89,229.81 20.86,229.81 27.28,223.54 27.28,220.87 | 27.28,220.87 v27.28,220.34 | v20.62,111.09 20.64,110.84 20.18,110.8 20.4,111.2 v20.62,111.09 | 27.28,220.87 27.06,220.47 v27.28,220.34 | 27.28,220.87 27.5,220.47 v27.28,220.34
  Bottom 0.254: 21.04,111.41 21.4,111.77 arc45 21.69,112.47 21.69,120.53 arc-45 21.98,121.24 23.46,122.72 arc45 24.02,124.07 24.02,150.5 27.28,153.76 27.28,219.82 | 21.04,111.41 20.72,111.09 v20.62,111.09 | v27.28,220.34 27.28,219.82 | 21.04,111.41 20.58,111.34 v20.62,111.09 | 21.04,111.41 20.85,110.99 v20.62,111.09 | 27.28,219.82 27.5,220.23 v27.28,220.34 | 27.28,219.82 27.06,220.23 v27.28,220.34
SCL  (via drill 0.35)
  Top 0.254: v7.62,125.73 7.62,126.15 arc-45 7.91,126.86 9.2,128.14 arc45 9.49,128.85 9.49,143.09 arc45 9.2,143.8 5.11,147.89 arc-45 3.31,152.22 U$1.6 | IC1.42 12.95,125.27 | 12.95,125.27 12.95,125.48 v12.7,125.73 | U1.1 6.69,126.25 arc-33 7.23,126.09 | 7.23,126.09 arc-12 7.39,125.96 v7.62,125.73 | 12.95,125.27 12.95,125.73 v12.7,125.73 | 12.95,125.27 12.56,125.52 v12.7,125.73 | v7.62,125.73 7.4,125.85 7.63,126.25 7.84,125.85 v7.62,125.73 | 7.23,126.09 7.38,125.65 v7.62,125.73 | 7.23,126.09 7.68,125.97 v7.62,125.73
  Bottom 0.254: v12.7,125.73 12.18,125.73 | 12.18,125.73 8.14,125.73 | 8.14,125.73 v7.62,125.73 | 12.18,125.73 12.58,125.51 v12.7,125.73 | 12.18,125.73 12.58,125.95 v12.7,125.73 | 8.14,125.73 7.74,125.95 v7.62,125.73 | 8.14,125.73 7.74,125.51 v7.62,125.73
SCLK  (via drill 0.35)
  Top 0.254: IC1.15 10.95,106.04 10.93,106.02 10.93,100.03 arc-45 10.64,99.33 arc45 10.53,99.07 10.53,95.65 | 10.53,95.65 v10.53,95.12 | X1.P$13 14.47,84.56 arc-45 14.75,85.23 arc45 15.04,85.94 15.04,86.16 v15.24,86.36 | v21.49,96.52 21.86,96.89 | 21.86,96.89 23.5,98.53 U2.6 | 10.53,95.65 10.31,95.24 v10.53,95.12 | 10.53,95.65 10.75,95.24 v10.53,95.12 | 21.86,96.89 21.42,96.76 v21.49,96.52 | 21.86,96.89 21.73,96.45 v21.49,96.52 | v15.24,86.36 15.4,86.16 15.04,85.87 14.99,86.33 v15.24,86.36
  Bottom 0.254: v10.53,95.12 10.53,95.19 arc-45 10.82,95.89 11.17,96.24 arc-45 11.87,96.53 20.96,96.53 | 20.96,96.53 v21.48,96.53 v21.49,96.52 | 15.24,86.89 15.24,89.29 arc45 14.5,91.08 10.87,94.72 | 15.24,86.89 v15.24,86.36 | v10.53,95.12 10.53,95.05 10.87,94.72 | v10.53,95.12 10.34,95.28 10.64,95.63 10.77,95.19 v10.53,95.12 | 10.87,94.72 10.78,95.17 v10.53,95.12 | 10.87,94.72 10.44,94.89 v10.53,95.12 | 20.96,96.53 21.37,96.3 v21.49,96.52 | 20.96,96.53 21.37,96.74 v21.49,96.52 | 15.24,86.89 15.02,86.48 v15.24,86.36 | 15.24,86.89 15.46,86.48 v15.24,86.36
SDA  (via drill 0.35)
  Top 0.254: IC1.43 12.45,124.35 arc45 12.19,124.99 arc-45 11.89,125.69 11.89,127.05 arc-45 12.19,127.76 12.33,127.9 | 12.33,127.9 v12.7,128.27 | v7.62,128.27 7.39,128.04 arc-12 7.23,127.91 | 7.23,127.91 arc-33 6.69,127.75 U1.4 | v7.62,128.27 7.99,128.64 | 7.99,128.64 8.38,129.03 8.4,129.03 arc45 8.69,129.74 8.69,142.03 arc45 8.4,142.73 3.84,147.29 arc-45 2.04,151.62 U$1.5 | 12.33,127.9 12.77,128.03 v12.7,128.27 | 12.33,127.9 12.46,128.34 v12.7,128.27 | 7.23,127.91 7.68,128.03 v7.62,128.27 | 7.23,127.91 7.38,128.35 v7.62,128.27 | 7.99,128.64 7.55,128.51 v7.62,128.27 | 7.99,128.64 7.86,128.2 v7.62,128.27
  Bottom 0.254: v12.7,128.27 12.18,128.27 | 12.18,128.27 8.14,128.27 | 8.14,128.27 v7.62,128.27 | 12.18,128.27 12.58,128.05 v12.7,128.27 | 12.18,128.27 12.58,128.49 v12.7,128.27 | 8.14,128.27 7.74,128.49 v7.62,128.27 | 8.14,128.27 7.74,128.05 v7.62,128.27
SRAM_CS
  Top 0.254: U2.1 26.04,105.27 arc45 25.74,105.97 24.27,107.45 arc45 23.56,107.74 IC1.25
SWCLK  (via drill 0.35)
  Top 0.254: IC1.37 16.56,115.85 | 16.56,115.85 16.88,116.17 v16.88,116.27 | U$7.P$3 13.03,232.73 13.03,230.79 11.73,229.31 6.58,229.31 3.17,226.09 3.17,218.97 | 3.17,218.97 v3.17,218.44 | 16.56,115.85 16.98,116.04 v16.88,116.27 | 16.56,115.85 16.63,116.31 v16.88,116.27 | 3.17,218.97 2.95,218.56 v3.17,218.44 | 3.17,218.97 3.4,218.56 v3.17,218.44
  Bottom 0.254: v16.88,116.27 17.41,116.27 | 17.41,116.27 18.17,116.27 arc45 18.87,116.56 19.52,117.21 19.52,171.61 3.17,187.96 3.17,217.92 | v3.17,218.44 3.17,217.92 | 17.41,116.27 17,116.49 v16.88,116.27 | 17.41,116.27 17,116.05 v16.88,116.27 | 3.17,217.92 3.4,218.32 v3.17,218.44 | 3.17,217.92 2.95,218.32 v3.17,218.44
SWDIO  (via drill 0.35)
  Top 0.254: IC1.34 16.97,112.26 19.12,112.26 arc45 19.83,112.55 19.99,112.72 arc-45 20.46,112.91 | 20.46,112.91 v20.98,112.91 | U$7.P$4 14.03,232.73 14.03,230.79 12.33,228.81 6.82,228.81 4.54,226.82 4.54,219.59 | 4.54,219.59 4.54,219.18 v4.45,219.07 | 20.46,112.91 20.86,112.69 v20.98,112.91 | 20.46,112.91 20.86,113.13 v20.98,112.91 | 4.54,219.59 4.25,219.24 v4.45,219.07 | 4.54,219.59 4.68,219.15 v4.45,219.07
  Bottom 0.254: v4.45,219.07 4.45,218.55 | 4.45,218.55 4.45,188.29 20.08,172.65 20.08,113.81 20.61,113.28 | v20.98,112.91 20.61,113.28 | 20.61,113.28 20.74,112.84 v20.98,112.91 | 20.61,113.28 21.05,113.15 v20.98,112.91 | 4.45,218.55 4.67,218.95 v4.45,219.07 | 4.45,218.55 4.22,218.95 v4.45,219.07
TX  (via drill 0.35)
  Top 0.254: v21.69,110.02 21.49,110.22 21.2,110.22 | 21.2,110.22 16.97,110.22 IC1.30 | v28.44,219.62 28.44,220.14 | 28.44,220.14 28.44,223.07 21.05,230.31 18.5,230.31 18,230.96 U$7.P$8 | 21.2,110.22 21.5,109.86 v21.69,110.02 | 21.2,110.22 21.66,110.27 v21.69,110.02 | 28.44,220.14 28.22,219.74 v28.44,219.62 | 28.44,220.14 28.66,219.74 v28.44,219.62
  Bottom 0.254: v21.69,110.02 21.69,110.55 | 21.69,110.55 21.69,110.83 arc-45 21.9,111.34 arc45 22.2,112.05 22.2,119.88 arc-45 22.49,120.59 24.48,122.58 arc45 24.96,123.76 24.96,150.5 28.44,153.97 28.44,219.09 | v28.44,219.62 28.44,219.09 | 21.69,110.55 21.47,110.14 v21.69,110.02 | 21.69,110.55 21.91,110.14 v21.69,110.02 | 28.44,219.09 28.66,219.5 v28.44,219.62 | 28.44,219.09 28.22,219.5 v28.44,219.62
USBDM
  Top 0.254: J1.D-1 22.07,110.98 arc-45 21.37,111.27 21.06,111.58 arc90 20.15,111.58 arc-45 19.33,111.24 IC1.32
USBDP
  Top 0.254: J1.D+1 22,111.63 arc-45 21.29,111.92 arc45 20.61,112.2 20.35,112.2 arc45 20.06,112.08 arc-45 19.23,111.74 IC1.33
VBAT
  Top 0.254: 23.46,125.06 23.76,125.36 arc45 24.77,127.79 24.77,139.29 arc45 24.47,139.99 22.11,142.35 arc-45 21.82,143.06 U$9.P2 | 23.46,125.06 23.46,122.93 arc-45 23.17,122.23 22.8,121.86 arc45 22.51,121.16 U$3.3 | 23.46,125.06 22.43,126.09 arc45 21.73,126.38 Q2.2
VCC  (via drill 0.35)
  Top 0.254: C3.1 18.63,104.16 16.84,105.95 arc45 16.14,106.24 IC1.24 15.45,106.91 13.09,109.27 | 13.09,109.27 13.04,109.32 13.04,109.27 8.48,109.27 IC1.9 0.46,109.24 0.44,109.22 | 10,113.24 IC1.1 8.15,113.24 7.22,114.17 arc-45 6.93,114.87 C5.1 C22.1 U$2.2 | 10,113.24 arc-45 10.46,113.05 12.65,110.86 | 12.65,110.86 12.75,110.76 arc-45 13.09,109.93 13.09,109.27 | IC1.48 9.95,113.29 10,113.24 | 1.9,124.47 0.92,123.31 arc40 0.44,122 0.44,109.22 | 12.65,110.86 14.74,112.95 arc-45 15.44,113.24 IC1.36 17.9,113.24 arc45 18.61,113.53 18.78,113.71 arc-45 19.49,114 22.78,114 arc45 23.49,114.29 23.76,114.56 | U1.3 5.86,127.25 arc-90 6.1,127.01 arc-90 5.84,126.75 U1.2 U1.9 2.5,126.75 arc-45 1.9,127 | C6.1 C4.1 0.73,106.2 arc-45 0.44,106.9 0.44,109.22 | R6.2 11.09,154.19 arc45 10.79,153.49 10.79,152.93 | 10.79,152.93 v10.79,152.4 | v7.62,133.99 7.62,133.46 | 7.62,133.46 7.62,131.23 C19.1 C20.1 2.19,128.34 arc45 1.9,127.63 1.9,127 | v24.13,114.94 23.76,114.56 | v27.3,123.83 27.3,124.35 | 27.3,124.35 27.3,125.09 S3.C | 1.9,127 1.9,124.47 | 1.9,124.47 3.4,125.98 U1.10 | 10.79,152.93 10.57,152.52 v10.79,152.4 | 10.79,152.93 11.02,152.52 v10.79,152.4 | 7.62,133.46 7.84,133.87 v7.62,133.99 | 7.62,133.46 7.4,133.87 v7.62,133.99 | 23.76,114.56 24.2,114.69 v24.13,114.94 | 23.76,114.56 23.89,115.01 v24.13,114.94 | 27.3,124.35 27.08,123.95 v27.3,123.83 | 27.3,124.35 27.53,123.95 v27.3,123.83
  Bottom 0.254: v10.79,152.4 10.42,152.03 | 10.42,152.03 7.91,149.52 arc45 7.62,148.81 7.62,134.51 | 7.62,134.51 v7.62,133.99 | v24.13,114.94 24.13,115.46 | 24.13,115.46 24.13,120.24 arc-45 24.42,120.94 26.93,123.45 | 26.93,123.45 v27.3,123.83 | 10.42,152.03 10.87,152.16 v10.79,152.4 | 10.42,152.03 10.55,152.47 v10.79,152.4 | 7.62,134.51 7.4,134.1 v7.62,133.99 | 7.62,134.51 7.84,134.1 v7.62,133.99 | 24.13,115.46 23.91,115.06 v24.13,114.94 | 24.13,115.46 24.35,115.06 v24.13,114.94 | 26.93,123.45 27.38,123.58 v27.3,123.83 | 26.93,123.45 27.06,123.9 v27.3,123.83
VOLT  (via drill 0.35)
  Top 0.254: 9.79,94.38 9.79,98.74 arc-45 10.08,99.44 10.13,99.49 arc45 10.42,100.2 10.42,106.21 IC1.14 | 9.79,94.38 v9.79,93.85 | 9.79,94.38 9.57,93.97 v9.79,93.85 | 9.79,94.38 10.01,93.97 v9.79,93.85
  Bottom 0.254: 2.91,65.14 6.87,69.1 arc45 7.61,70.9 7.61,87.9 arc-45 7.91,88.61 9.5,90.2 arc45 9.79,90.91 9.79,93.33 | 2.91,65.14 VREF.TP | 9.79,93.33 v9.79,93.85 | 9.79,93.33 10.01,93.73 v9.79,93.85 | 9.79,93.33 9.57,93.73 v9.79,93.85 | 2.91,65.14 2.47,65.01 VREF.TP | 2.91,65.14 2.78,64.7 VREF.TP
  other vias: 2.54,64.77
WAKEUP  (via drill 0.35)
  Top 0.254: S3.T 19.73,130.81 arc45 19.03,130.52 14.24,125.73 arc45 13.95,125.03 IC1.40 13.95,113.59 | 13.95,113.59 13.95,113.09 v13.93,113.07 | v10.16,108.59 10.01,108.74 9.66,108.74 | 9.66,108.74 IC1.10 | 13.95,113.59 13.71,113.2 v13.93,113.07 | 13.95,113.59 14.15,113.18 v13.93,113.07 | 9.66,108.74 9.98,108.41 v10.16,108.59 | 9.66,108.74 10.11,108.83 v10.16,108.59
  Bottom 0.254: v13.93,113.07 13.56,112.7 | 13.56,112.7 10.45,109.59 arc45 10.16,108.89 v10.16,108.59 | 13.56,112.7 14,112.83 v13.93,113.07 | 13.56,112.7 13.69,113.14 v13.93,113.07 | v10.16,108.59 9.95,108.72 10.19,109.11 10.39,108.69 v10.16,108.59
WAKEUP2
  Top 0.254: IC1.2 8.42,112.71 7.83,112.71 6.01,114.54 arc-45 5.71,115.24 5.71,119.27 arc45 5.42,119.97 4.4,120.99 arc-45 4.11,121.7 U1.11

### Text on the board
Top: 46 69 / 78 20 74 / 68 65 20 / 72 61 64 / 69 6f
tNames: GND | RST | SWCLK | SWDIO | 5V | GND | RX | TX | U$11
Document: e-paper display area | LED | recommend / covering / protecting | Componets